# Altium schematic sheet ShiftRegister.SchDoc
size A3; SheetNumber: 6; SheetTotal: 11
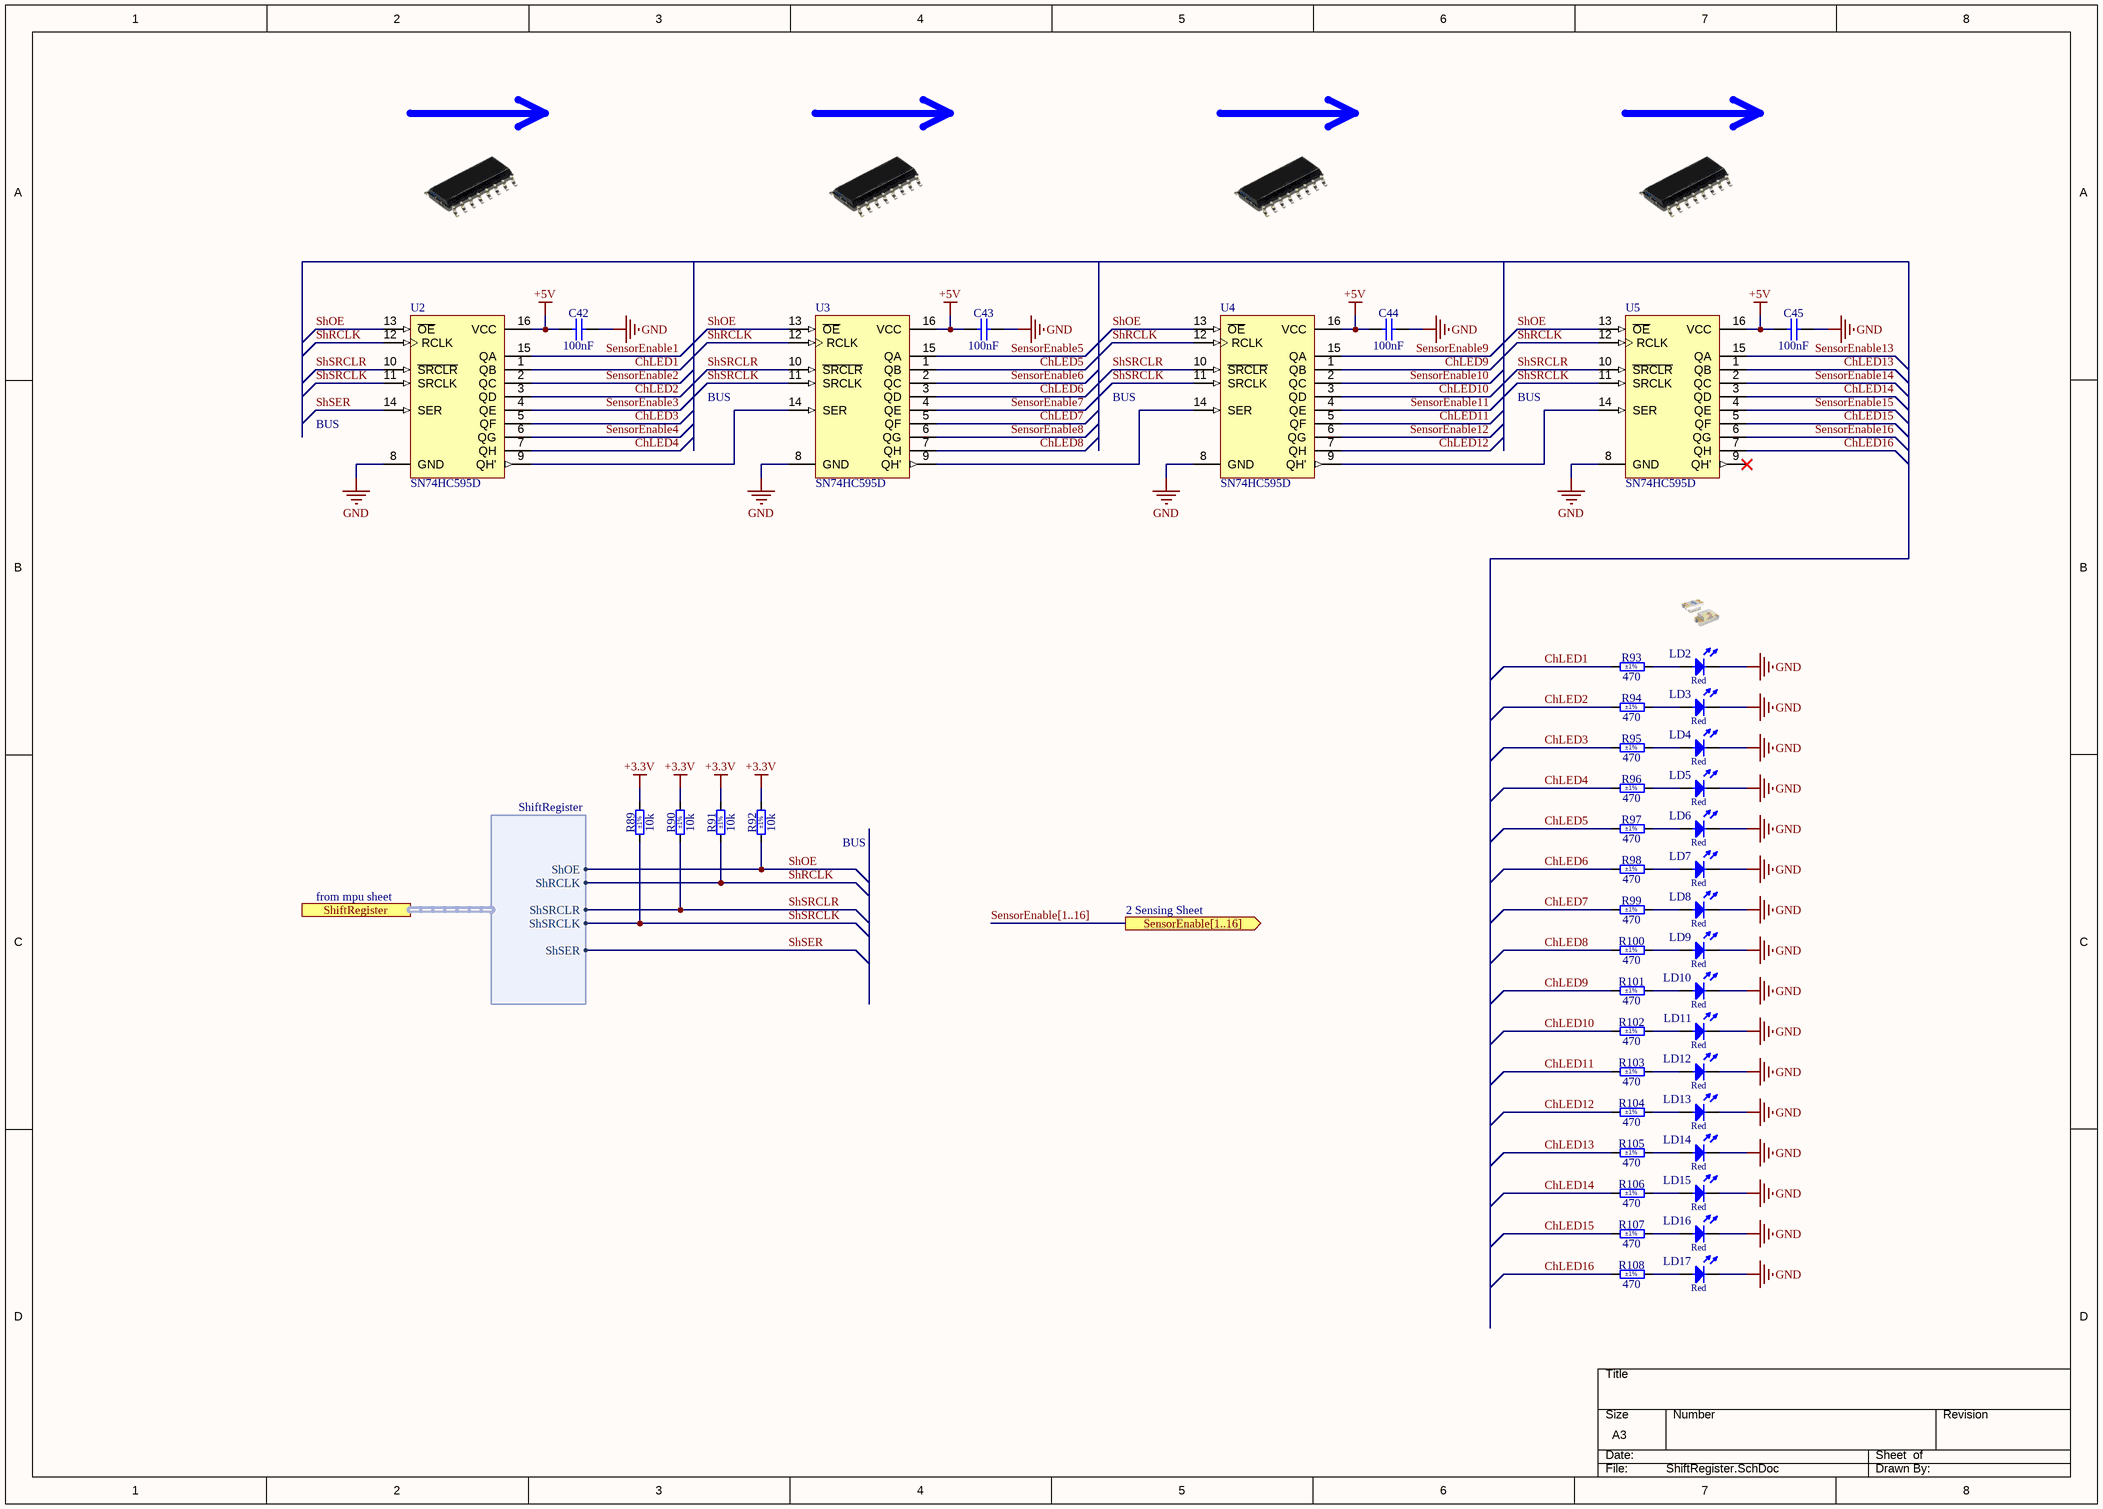
[diagram p0: ShiftRegister.SchDoc]

## Parts
C42  100nF  [CAPC1608X87N]
C43  100nF  [CAPC1608X87N]
C44  100nF  [CAPC1608X87N]
C45  100nF  [CAPC1608X87N]
LD2  Red  [LED_AVAGO_HSMH-C150]
LD3  Red  [LED_AVAGO_HSMH-C150]
LD4  Red  [LED_AVAGO_HSMH-C150]
LD5  Red  [LED_AVAGO_HSMH-C150]
LD6  Red  [LED_AVAGO_HSMH-C150]
LD7  Red  [LED_AVAGO_HSMH-C150]
LD8  Red  [LED_AVAGO_HSMH-C150]
LD9  Red  [LED_AVAGO_HSMH-C150]
LD10  Red  [LED_AVAGO_HSMH-C150]
LD11  Red  [LED_AVAGO_HSMH-C150]
LD12  Red  [LED_AVAGO_HSMH-C150]
LD13  Red  [LED_AVAGO_HSMH-C150]
LD14  Red  [LED_AVAGO_HSMH-C150]
LD15  Red  [LED_AVAGO_HSMH-C150]
LD16  Red  [LED_AVAGO_HSMH-C150]
LD17  Red  [LED_AVAGO_HSMH-C150]
R89  10k  Tolerance: ±1%  [RESC1608X55N]
R90  10k  Tolerance: ±1%  [RESC1608X55N]
R91  10k  Tolerance: ±1%  [RESC1608X55N]
R92  10k  Tolerance: ±1%  [RESC1608X55N]
R93  470  Tolerance: ±1%  [RESC1608X55N]
R94  470  Tolerance: ±1%  [RESC1608X55N]
R95  470  Tolerance: ±1%  [RESC1608X55N]
R96  470  Tolerance: ±1%  [RESC1608X55N]
R97  470  Tolerance: ±1%  [RESC1608X55N]
R98  470  Tolerance: ±1%  [RESC1608X55N]
R99  470  Tolerance: ±1%  [RESC1608X55N]
R100  470  Tolerance: ±1%  [RESC1608X55N]
R101  470  Tolerance: ±1%  [RESC1608X55N]
R102  470  Tolerance: ±1%  [RESC1608X55N]
R103  470  Tolerance: ±1%  [RESC1608X55N]
R104  470  Tolerance: ±1%  [RESC1608X55N]
R105  470  Tolerance: ±1%  [RESC1608X55N]
R106  470  Tolerance: ±1%  [RESC1608X55N]
R107  470  Tolerance: ±1%  [RESC1608X55N]
R108  470  Tolerance: ±1%  [RESC1608X55N]
U2  SN74HC595D  [SO16]
U3  SN74HC595D  [SO16]
U4  SN74HC595D  [SO16]
U5  SN74HC595D  [SO16]

## Ports
SensorEnable[1..16] (out), ShiftRegister (harness ShiftRegister)

## Harnesses
ShiftRegister: ShOE, ShRCLK, ShSRCLR, ShSRCLK, ShSER

## Nets
+3.3V: R89.2 R90.2 R91.2 R92.2
+5V: C42.1 C43.1 C44.1 C45.1 U2.16(VCC) U3.16(VCC) U4.16(VCC) U5.16(VCC)
GND: C42.2 C43.2 C44.2 C45.2 LD2.1(C) LD3.1(C) LD4.1(C) LD5.1(C) LD6.1(C) LD7.1(C) LD8.1(C) LD9.1(C) LD10.1(C) LD11.1(C) LD12.1(C) LD13.1(C) LD14.1(C) LD15.1(C) LD16.1(C) LD17.1(C) U2.8(GND) U3.8(GND) U4.8(GND) U5.8(GND)
ChLED1: R93.1 U2.1(QB)
ChLED2: R94.1 U2.3(QD)
ChLED3: R95.1 U2.5(QF)
ChLED4: R96.1 U2.7(QH)
ChLED5: R97.1 U3.1(QB)
ChLED6: R98.1 U3.3(QD)
ChLED7: R99.1 U3.5(QF)
ChLED8: R100.1 U3.7(QH)
ChLED9: R101.1 U4.1(QB)
ChLED10: R102.1 U4.3(QD)
ChLED11: R103.1 U4.5(QF)
ChLED12: R104.1 U4.7(QH)
ChLED13: R105.1 U5.1(QB)
ChLED14: R106.1 U5.3(QD)
ChLED15: R107.1 U5.5(QF)
ChLED16: R108.1 U5.7(QH)
SensorEnable1: U2.15(QA)
SensorEnable2: U2.2(QC)
SensorEnable3: U2.4(QE)
SensorEnable4: U2.6(QG)
SensorEnable5: U3.15(QA)
SensorEnable6: U3.2(QC)
SensorEnable7: U3.4(QE)
SensorEnable8: U3.6(QG)
SensorEnable9: U4.15(QA)
SensorEnable10: U4.2(QC)
SensorEnable11: U4.4(QE)
SensorEnable12: U4.6(QG)
SensorEnable13: U5.15(QA)
SensorEnable14: U5.2(QC)
SensorEnable15: U5.4(QE)
SensorEnable16: U5.6(QG)
ShOE: R92.1 U2.13(~{OE}) U3.13(~{OE}) U4.13(~{OE}) U5.13(~{OE}) ; port ShiftRegister.ShOE
ShRCLK: R91.1 U2.12(RCLK) U3.12(RCLK) U4.12(RCLK) U5.12(RCLK) ; port ShiftRegister.ShRCLK
ShSER: U2.14(SER) ; port ShiftRegister.ShSER
ShSRCLK: R89.1 U2.11(SRCLK) U3.11(SRCLK) U4.11(SRCLK) U5.11(SRCLK) ; port ShiftRegister.ShSRCLK
ShSRCLR: R90.1 U2.10(~{SRCLR}) U3.10(~{SRCLR}) U4.10(~{SRCLR}) U5.10(~{SRCLR}) ; port ShiftRegister.ShSRCLR
NetLD2_2: LD2.2(A) R93.2
NetLD3_2: LD3.2(A) R94.2
NetLD4_2: LD4.2(A) R95.2
NetLD5_2: LD5.2(A) R96.2
NetLD6_2: LD6.2(A) R97.2
NetLD7_2: LD7.2(A) R98.2
NetLD8_2: LD8.2(A) R99.2
NetLD9_2: LD9.2(A) R100.2
NetLD10_2: LD10.2(A) R101.2
NetLD11_2: LD11.2(A) R102.2
NetLD12_2: LD12.2(A) R103.2
NetLD13_2: LD13.2(A) R104.2
NetLD14_2: LD14.2(A) R105.2
NetLD15_2: LD15.2(A) R106.2
NetLD16_2: LD16.2(A) R107.2
NetLD17_2: LD17.2(A) R108.2
NetU2_9: U2.9(QH') U3.14(SER)
NetU3_9: U3.9(QH') U4.14(SER)
NetU4_9: U4.9(QH') U5.14(SER)

Not connected (* = marked no-connect by the designer): U5 9(QH')*

## Buses and harness runs
bus SensorEnable[1..16] = port SensorEnable[1..16]

## Notes on the sheet
- BUS
- from mpu sheet
- 2 Sensing Sheet
- THIS DOCUMENT AND THE DATA DISCLOSED HEREIN OR
- HEREWITH IS THE PROPERTY OF ALTIUM LIMITED AND MAY
- DWG NO:
- REVISION
- REV:
- DESCRIPTION
- DATE
- APPROVED
- BE FREELY DISTRIBUTED IN WHOLE. NO RIGHTS ARE
- RESERVED OR EXPRESS OR IMPLIED WARANTEE GIVEN.
- ENG:
- APPROVALS
- PROJECT
- DSN:
- CHK:
- REFERENCE DOCUMENTS
- PROJECT REVISION:
- TITLE
- DOCUMENT REVISION:
- DESIGN ITEM:
- BOM:
- FAB DWG:
- PCB DWG:
- ASSY DWG:
- SCALE:
- A3
- SIZE
- CAGE CODE
- FILE NAME
- DWG NO.
- SHEET
- OF
- REV

## Library data of the parts
C42-C45 = CC0603_100NF_50V_10%_X7R: Non-polarised capacitor; Part Description: SMD Multilayer Chip Ceramic Capacitor; Manufacturer: GENERIC; Manufacturer1 Part Number: 223858615649; Voltage: 50V; TC: X7R; Tolerance: ±10%; Part Number: CC0603_100NF_50V_10%_X7R; Component Kind: Standard; Component Type: Standard; Pin Count: 2; Value: 100nF; Status: Preferred; Manufacturer Part Number: CC0603_100NF_50V_10%_X7R; Case: 0603; Mounted: Yes; Socket: No; SMD: Yes; Sense: No; Manufacturer1 Example: PHYCOMP; Manufacturer1 ComponentHeight: 0.87mm; HelpURL: \\cern.ch\dfs\Applications\Altium\Datasheets\CC0603_X7R_PHYCOMP.pdf; Author: CERN DEM JLC; CreateDate: 03.12.2007; LatestRevisionDate: 03.12.2007
LD2-LD17 = LED_AVAGO_HSMH-C150: LED Red 1C 2A; Part Description: Red Diffused Surface Mount LED (1206 Case); Manufacturer: AVAGO TECHNOLOGIES; PressFit: No; Bonding: No; Part Number: LED_AVAGO_HSMH-C150; Component Kind: Standard; Component Type: Standard; Color: Red; PackageDescription: Red Diffused Chip LED, 2-Leads, Body 3.2 x1.6mm, IPC Medium Density; Manufacturer Part Number: HSMH-C150; Pin Count: 2; Case: 1206; Mounted: Yes; Socket: No; SMD: Yes; Sense: No; ComponentHeight: 1.2mm; HelpURL: \\cern.ch\dfs\Applications\Altium\Datasheets\LED_AVAGO_HSMH-C150.pdf; Author: CERN DEM JLC; CreateDate: 08.03.2018; LatestRevisionDate: 08.03.2018
R89-R92 = R0603_10K_1%_0.1W_100PPM: Resistor - 1%; Part Description: General Purpose Thick Film Chip Resistor; Manufacturer: GENERIC; Manufacturer1 Part Number: NRC06F1002TRF; Power: 0.1W; TC: ±100ppm/°C; PressFit: No; Part Number: R0603_10K_1%_0.1W_100PPM; Component Kind: Standard; Component Type: Standard; Pin Count: 2; Value: 10k; Status: Preferred; Manufacturer Part Number: R0603_10K_1%_0.1W_100PPM; Case: 0603; Mounted: Yes; Sense: No; Socket: No; SMD: Yes; Manufacturer1 Example: NIC COMPONENT; Manufacturer1 ComponentHeight: 0.55mm; HelpURL: \\cern.ch\dfs\Applications\Altium\Datasheets\R0603_NIC_NRC.pdf; Author: CERN DEM JLC; CreateDate: 03.12.2007; LatestRevisionDate: 13.03.2008
R93-R108 = R0603_470R_1%_0.1W_100PPM: Resistor - 1%; Part Description: General Purpose Thick Film Chip Resistor; Manufacturer: GENERIC; Manufacturer1 Part Number: NRC06F4700TRF; Power: 0.1W; TC: ±100ppm/°C; PressFit: No; Part Number: R0603_470R_1%_0.1W_100PPM; Component Kind: Standard; Component Type: Standard; Pin Count: 2; Value: 470; Status: Preferred; Manufacturer Part Number: R0603_470R_1%_0.1W_100PPM; Case: 0603; Mounted: Yes; Sense: No; Socket: No; SMD: Yes; Manufacturer1 Example: NIC COMPONENT; Manufacturer1 ComponentHeight: 0.55mm; HelpURL: \\cern.ch\dfs\Applications\Altium\Datasheets\R0603_NIC_NRC.pdf; Author: CERN DEM JLC; CreateDate: 03.12.2007; LatestRevisionDate: 13.03.2008
U2-U5 = SN74HC595D: 8-Bit Shift Register with 3-State Output Registers; Published: 8-Jun-2000; LatestRevisionDate: 13-Apr-2006; LatestRevisionNote: IPC-7351 Footprint Added.; DatasheetVersion: May-1997; PackageVersion: Jan-1998; PackageReference: D016; Publisher: Altium Limited; PackageDescription: 16-Pin Small Outline Integrated Circuit 1.27 mm Pitch; Code_IPC: SOIC127P600-16; ComponentLink1Description: Manufacturer Link; ComponentLink1URL: http://www.ti.com/; ComponentLink2Description: Datasheet; ComponentLink2URL: http://www-s.ti.com/sc/ds/sn74hc595.pdf